# Altium schematic sheet digi_pwr.SchDoc
size A4
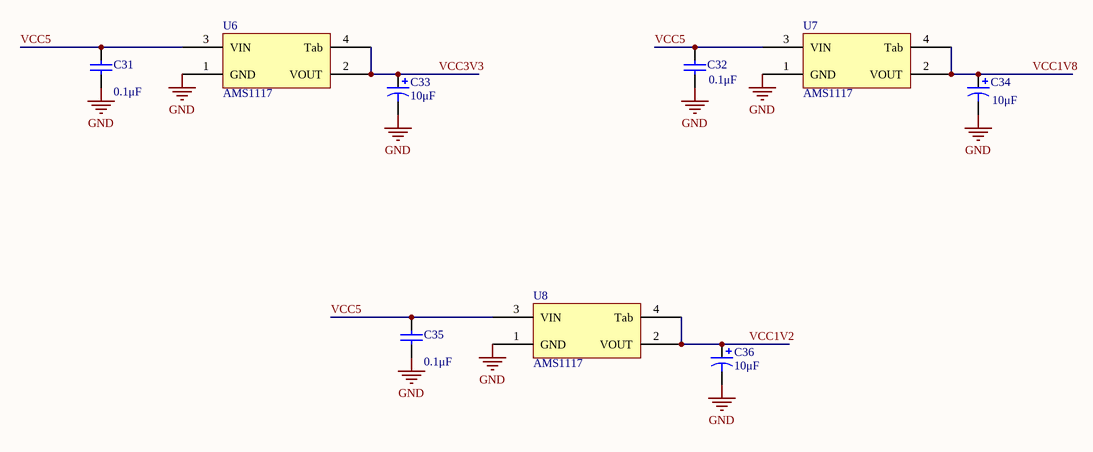
[diagram p0: digi_pwr.SchDoc]

## Parts
C31  value 0.1μF  [1608[0603]]  (hidden comment: Cap Semi)
C32  value 0.1μF  [1608[0603]]  (hidden comment: Cap Semi)
C33  value 10μF  [C0805]  (hidden comment: Cap Pol3)
C34  value 10μF  [C0805]  (hidden comment: Cap Pol3)
C35  value 0.1μF  [1608[0603]]  (hidden comment: Cap Semi)
C36  value 10μF  [C0805]  (hidden comment: Cap Pol3)
U6  AMS1117  [SOT-223]
U7  AMS1117  [SOT-223]
U8  AMS1117  [SOT-223]

## Nets
GND: C31.1 C32.1 C33.2 C34.2 C35.1 C36.2 U6.1(GND) U7.1(GND) U8.1(GND)
VCC1V2: C36.1 U8.2(VOUT) U8.4(Tab)
VCC1V8: C34.1 U7.2(VOUT) U7.4(Tab)
VCC3V3: C33.1 U6.2(VOUT) U6.4(Tab)
VCC5: C31.2 C32.2 C35.2 U6.3(VIN) U7.3(VIN) U8.3(VIN)

## Library data of the parts
C31 C32 C35 = Cap Semi: Capacitor (Semiconductor SIM Model); Published: 8-Jun-2000; LatestRevisionDate: 29-May-2009; LatestRevisionNote: IPC-7351 Footprint Added.; PackageReference: C1206; Publisher: Altium Limited; PackageDescription: Chip Capacitor
C33 C34 C36 = Cap Pol3: Polarized Capacitor (Surface Mount); Published: 8-Jun-2000; LatestRevisionDate: 29-May-2009; LatestRevisionNote: IPC-7351 Footprint Added.; PackageReference: C0805; Publisher: Altium Limited; PackageDescription: Chip Capacitor